# Altium schematic sheet ram.SchDoc: SDRAM 32MB + SRAM 2MB
size A4; Author: Sorgelig; Revision: 1.1; SheetNumber: 1; SheetTotal: 3
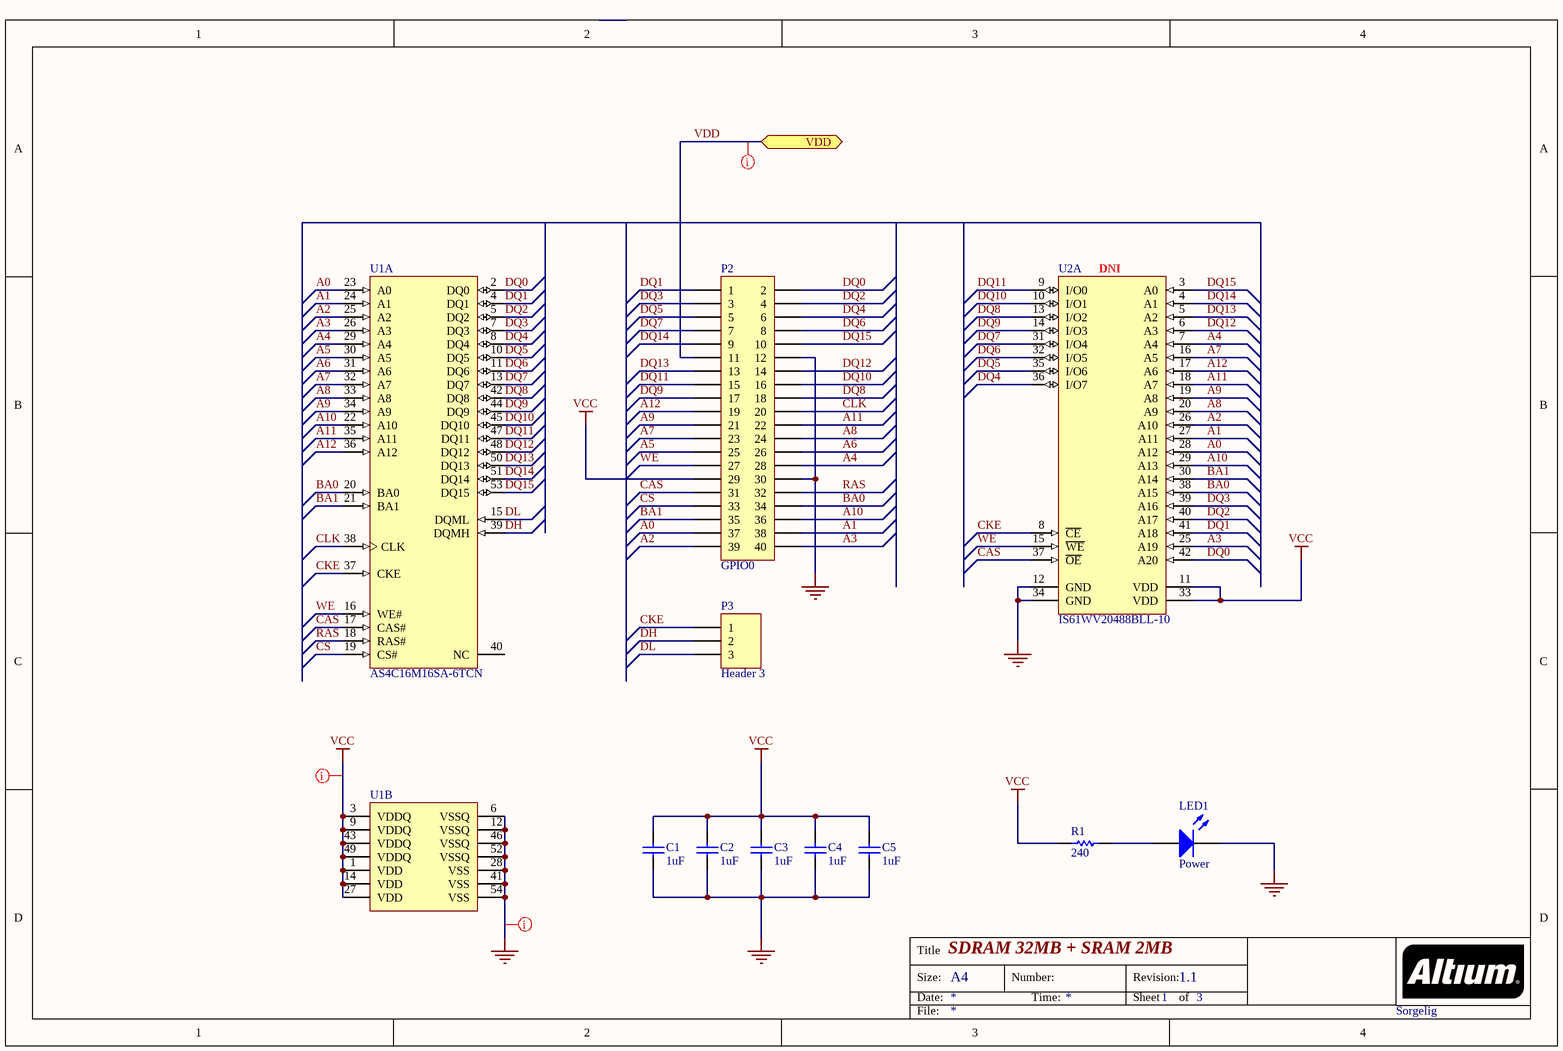
[diagram p0: ram.SchDoc]

## Parts
C1  value 1uF  [C0805]  (hidden comment: C0805)
C2  value 1uF  [C0805]  (hidden comment: C0805)
C3  value 1uF  [C0805]  (hidden comment: +)
C4  value 1uF  [C0805]  (hidden comment: C0805)
C5  value 1uF  [C0805]  (hidden comment: +)
LED1  Power  [LEDB0805]
P2  GPIO0  [HDR20x2]
P3  Header 3  [HDR1X3]
R1  240  [R0805]
U1  AS4C16M16SA-6TCN  [TSOP54]  (parts A,B of 2)
U2  IS61WV20488BLL-10  [ISSI-TSOP-2-44_N]  (part A of 2)

## Ports
VDD

## Nets
GND: C1.1 C2.1 C3.1 C4.1 C5.1 LED1.2(K) P2.12 P2.30 U1.6(VSSQ) U1.12(VSSQ) U1.28(VSS) U1.41(VSS) U1.46(VSSQ) U1.52(VSSQ) U1.54(VSS) U2.12(GND) U2.34(GND)
VCC: C1.2 C2.2 C3.2 C4.2 C5.2 P2.29 R1.2 U1.1(VDD) U1.3(VDDQ) U1.9(VDDQ) U1.14(VDD) U1.27(VDD) U1.43(VDDQ) U1.49(VDDQ) U2.11(VDD) U2.33(VDD)
A0: P2.37 U1.23(A0) U2.28(A12)
A1: P2.38 U1.24(A1) U2.27(A11)
A2: P2.39 U1.25(A2) U2.26(A10)
A3: P2.40 U1.26(A3) U2.25(A19)
A4: P2.28 U1.29(A4) U2.7(A4)
A5: P2.25 U1.30(A5)
A6: P2.26 U1.31(A6)
A7: P2.23 U1.32(A7) U2.16(A5)
A8: P2.24 U1.33(A8) U2.20(A9)
A9: P2.21 U1.34(A9) U2.19(A8)
A10: P2.36 U1.22(A10) U2.29(A13)
A11: P2.22 U1.35(A11) U2.18(A7)
A12: P2.19 U1.36(A12) U2.17(A6)
BA0: P2.34 U1.20(BA0) U2.38(A15)
BA1: P2.35 U1.21(BA1) U2.30(A14)
CAS: P2.31 U1.17(CAS#) U2.37(~{OE})
CKE: P3.1 U1.37(CKE) U2.8(~{CE})
CLK: P2.20 U1.38(CLK)
CS: P2.33 U1.19(CS#)
DH: P3.2 U1.39(DQMH)
DL: P3.3 U1.15(DQML)
DQ0: P2.2 U1.2(DQ0) U2.42(A20)
DQ1: P2.1 U1.4(DQ1) U2.41(A18)
DQ2: P2.4 U1.5(DQ2) U2.40(A17)
DQ3: P2.3 U1.7(DQ3) U2.39(A16)
DQ4: P2.6 U1.8(DQ4) U2.36(I/O7)
DQ5: P2.5 U1.10(DQ5) U2.35(I/O6)
DQ6: P2.8 U1.11(DQ6) U2.32(I/O5)
DQ7: P2.7 U1.13(DQ7) U2.31(I/O4)
DQ8: P2.18 U1.42(DQ8) U2.13(I/O2)
DQ9: P2.17 U1.44(DQ9) U2.14(I/O3)
DQ10: P2.16 U1.45(DQ10) U2.10(I/O1)
DQ11: P2.15 U1.47(DQ11) U2.9(I/O0)
DQ12: P2.14 U1.48(DQ12) U2.6(A3)
DQ13: P2.13 U1.50(DQ13) U2.5(A2)
DQ14: P2.9 U1.51(DQ14) U2.4(A1)
DQ15: P2.10 U1.53(DQ15) U2.3(A0)
RAS: P2.32 U1.18(RAS#)
VDD: P2.11 ; port VDD
WE: P2.27 U1.16(WE#) U2.15(~{WE})
NetLED1_1: LED1.1(A) R1.1

Not connected (* = marked no-connect by the designer): U1 40(NC)

## Layout directives
net class power: GND, VCC, VDD

## Notes on the sheet
- (near U2) DNI
- Sorgelig
- Title
- Size:
- Date:
- A4
- Number:
- Time:
- Revision:
- Sheet
- of
- File:

## Library data of the parts
C1-C5 = C0805: Ceramic Chip Capacitor - Standard; Note: Footprint corresponds to dimensions for bulk cassette packaging. This case size has tightened tolerances.; Published: 17-Jul-2002; LatestRevisionDate: 19-Mar-2004; LatestRevisionNote: Silkscreen size reduced.; DatasheetDocument: Mar-2001; PackageDocument: Mar-2001; PackageReference: 0805; Publisher: Altium Limited; Code_JEITA: 0805; Code_IPC: 2012[0805]; ComponentLink1Description: Manufacturer Link; ComponentLink1URL: http://www.kemet.com/; ComponentLink2Description: Datasheet; ComponentLink2URL: http://www.kemet.com/kemet/web/homepage/kechome.nsf/vapubfilesname/F3102TA.pdf/$file/F3102TA.pdf
LED1 = LED2: Typical RED, GREEN, YELLOW, AMBER GaAs LED; Published: 8-Jun-2000; LatestRevisionDate: 17-Jul-2002; LatestRevisionNote: Re-released for DXP Platform.; PackageVersion: Feb-2002; PackageReference: 3.2X1.6X1.1; Publisher: Altium Limited; PackageDescription: SM LED; 2 Flat Leads
P2 = Header 20X2: Header, 20-Pin, Dual row; LatestRevisionDate: 17-Jul-2002; LatestRevisionNote: Re-released for DXP Platform.; Publisher: Altium Limited
P3 = Header 3: Header, 3-Pin; LatestRevisionDate: 17-Jul-2002; LatestRevisionNote: Re-released for DXP Platform.; Publisher: Altium Limited
R1 = ERJ6RS: Low Ohmic Value Thick Film Chip Resistor, 0.1 Ohm to 0.2 Ohm Range, 1%, 2% and 5% Tolerance, 0805 Size, 0.125 W; Published: 17-Dec-2003; LatestRevisionDate: 19-Mar-2004; LatestRevisionNote: Silkscreen size reduced.; PackageDocument: Mar-2003; PackageReference: 6-0805; Publisher: Altium Limited; Code_IPC: 2012 [0805]; ComponentLink1Description: Manufacturer Link; ComponentLink1URL: http://www.panasonic.com/industrial/components/resistive_products.htm; ComponentLink2Description: Datasheet; ComponentLink2URL: http://www.panasonic.com/industrial/components/pdf/AOA0000CE3.pdf
U1 = AS4C16M16SA-6TCN: 256Mb SDR SDRAM, 16Mb x 16, 6ns, 3.3V, 54-Pin TSOP; Manufacturer: Micron; PartNumber: MT48LC16M16A2P-6A; CL: CL = 3; Clock Rate: 167 MHz; Data Rate: PC133; Op. Temp.: 0C to +70C; DatasheetVersion: Rev.Q; PackageVersion: Rev.Q; PackageReference: MICT-P-54; PackageDescription: 54-Pin Thin Small Outline Package, 10.16 x 22.22 mm, Pitch 0.8 mm; Cycle Time: 6ns; Density: 256Mb; Depth: 16Mb; RoHS: Yes; Voltage: 3.3V; Width: x16; Mounting Technology: Surface Mount; ComponentLink1Description: Manufacturer URL; ComponentLink1URL: http://www.micron.com/; ComponentLink2Description: Datasheet; ComponentLink2URL: http://www.micron.com/~/media/Documents/Products/Data%20Sheet/DRAM/256Mb_sdr.pdf; ComponentLink3Description: Package Specification; ComponentLink3URL: http://www.micron.com/~/media/Documents/Products/Data%20Sheet/DRAM/128mb_x4x8x16_sdram.pdf
U2 = IS61WV20488BLL-10TI: 16 M High Speed CMOS SRAM, 2 M x 8, -40 to 85 degC, 44-Pin SOP (TSOP-2-44); Manufacturer: Integrated Silicon Solution Inc (ISSI); Organization: 2M x 8; Packing: Tray / Tube; Speed (ns): 10; DatasheetVersion: Rev. B; PackageVersion: Rev. F, 06/2008; PackageReference: TSOP-2-44; PackageDescription: 44-Pin 400 mil TSOP-2, Body 18.41 x 10.16 mm, Pitch 0.8 mm; Mounting Technology: Surface Mount; PartNumber: IS61WV20488BLL-10TI; ComponentLink1Description: Manufacturer URL; ComponentLink1URL: http://www.issi.com/US/index.shtml; ComponentLink2Description: Datasheet; ComponentLink2URL: http://www.issi.com/WW/pdf/61-64WV20488.pdf; ComponentLink3Description: Package Specification; ComponentLink3URL: http://www.issi.com/WW/pdf/61-64WV6416EEBLL.pdf